# EAGLE schematic avr_lag2 (EAGLE 5.07)
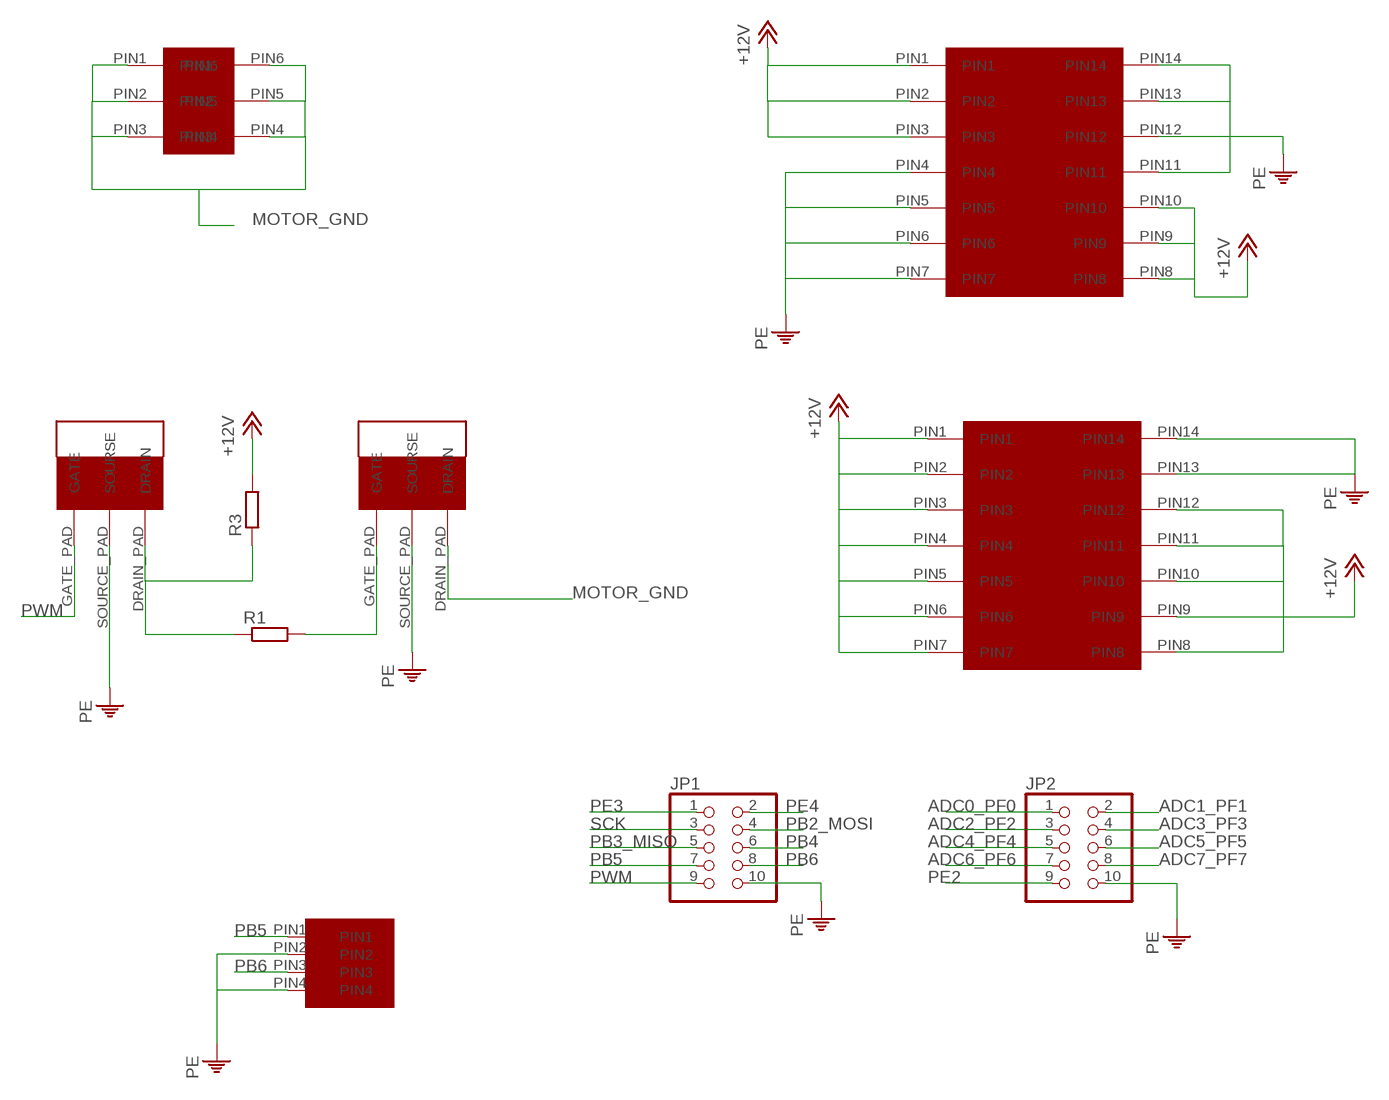
[diagram p0: schematic, sheet 1]

## Parts
JP1  PINHD-2X5  [2X05]
JP2  PINHD-2X5  [2X05]
R1  R-EU_0207/10  [0207/10]
R3  R-EU_0207/10  [0207/10]
U$1  IRFZ46N  [IRFZ46N]
U$2  IRFZ46N  [IRFZ46N]
U$3  MICROFIT14  [MICROFIT14SOCK]
U$4  MICROFIT14  [MICROFIT14SOCK]
U$5  MICROFIT6  [MICROFIT6SOCK]
U$6  MICROFIT4  [MICROFIT4SOCK]

## Nets
+12V: R3.2 U$3.PIN1 U$3.PIN2 U$3.PIN3 U$3.PIN8 U$3.PIN9 U$3.PIN10 U$4.PIN1 U$4.PIN2 U$4.PIN3 U$4.PIN4 U$4.PIN5 U$4.PIN6 U$4.PIN7 U$4.PIN8 U$4.PIN9 U$4.PIN10 U$4.PIN11 U$4.PIN12
ADC0_PF0: JP2.1
ADC1_PF1: JP2.2
ADC2_PF2: JP2.3
ADC3_PF3: JP2.4
ADC4_PF4: JP2.5
ADC5_PF5: JP2.6
ADC6_PF6: JP2.7
ADC7_PF7: JP2.8
MOTOR_GND: U$2.DRAIN_PAD(DRAIN) U$5.PIN1 U$5.PIN2 U$5.PIN3 U$5.PIN4 U$5.PIN5 U$5.PIN6
N$1: R1.1 R3.1 U$1.DRAIN_PAD(DRAIN)
N$2: R1.2 U$2.GATE_PAD(GATE)
PB2_MOSI: JP1.4
PB3_MISO: JP1.5
PB4: JP1.6
PB5: JP1.7 U$6.PIN1
PB6: JP1.8 U$6.PIN3
PE: JP1.10 JP2.10 U$1.SOURCE_PAD(SOURSE) U$2.SOURCE_PAD(SOURSE) U$3.PIN4 U$3.PIN5 U$3.PIN6 U$3.PIN7 U$3.PIN11 U$3.PIN12 U$3.PIN13 U$3.PIN14 U$4.PIN13 U$4.PIN14 U$6.PIN2 U$6.PIN4
PE2: JP2.9
PE3: JP1.1
PE4: JP1.2
PWM: JP1.9 U$1.GATE_PAD(GATE)
SCK: JP1.3

## Library data of the parts
JP1 JP2 = pinhead:PINHD-2X5: PIN HEADER
R1 R3 = resistor:R-EU_: RESISTOR, European symbol
U$1 U$2 = unicorn:IRFZ46N
U$3 U$4 = unicorn:MICROFIT14
U$5 = unicorn:MICROFIT6
U$6 = unicorn:MICROFIT4